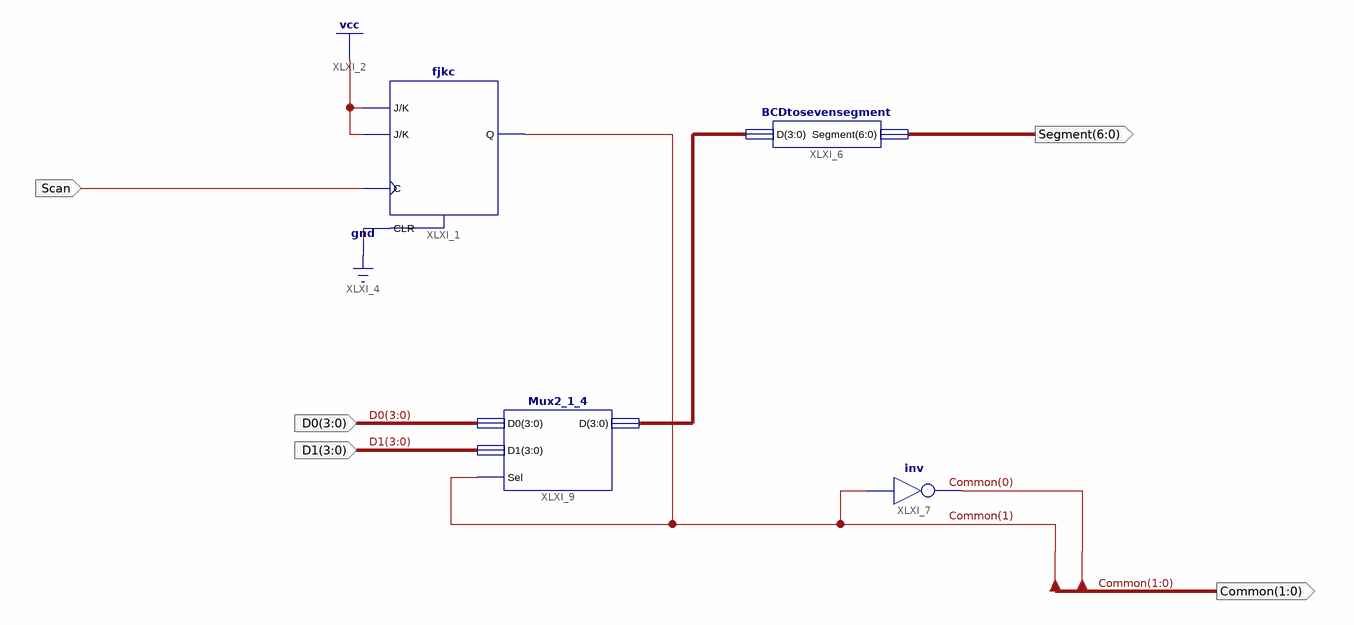
[diagram p0: schematic sheet 1]
// Xilinx ISE schematic Scandigit.sch (spartan6) as structural Verilog: 4 symbols, 5 ports
module Scandigit (
  input  Scan,
  input  [3:0] D0,
  input  [3:0] D1,
  output [6:0] Segment,
  output [1:0] Common
);

  wire [3:0] XLXN_33;

  fjkc XLXI_1 (.C(Scan), .CLR(1'b0), .J(1'b1), .K(1'b1), .Q(Common[1]));
  BCDtosevensegment XLXI_6 (.D(XLXN_33), .Segment(Segment));
  not XLXI_7 (Common[0], Common[1]);
  Mux2_1_4 XLXI_9 (.D(XLXN_33), .D0(D0), .D1(D1), .Sel(Common[1]));
endmodule
